# EAGLE design mppt (EAGLE 6.3)
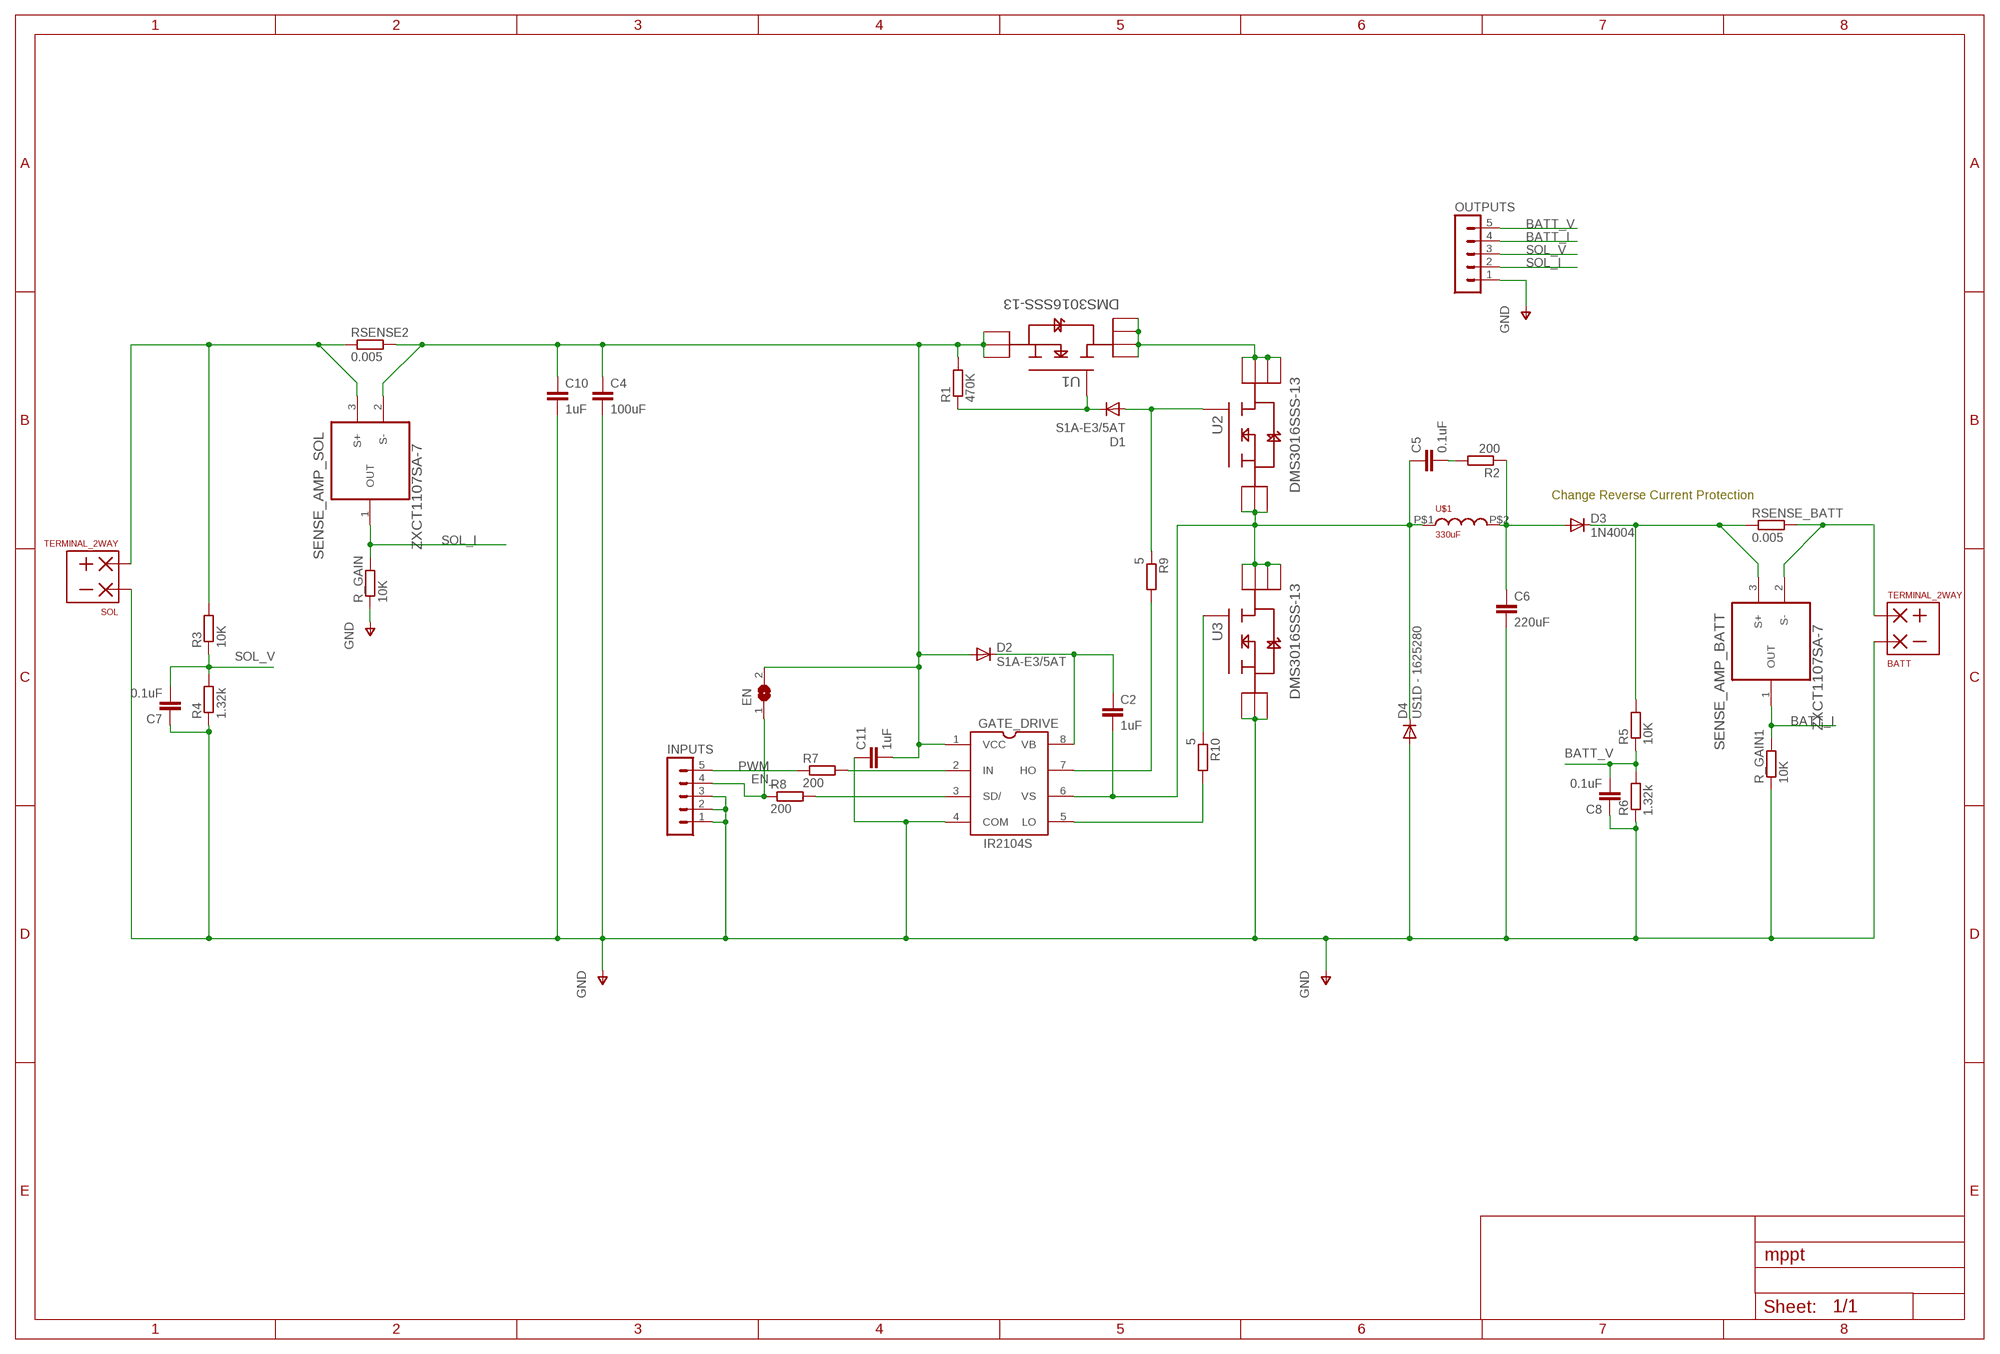
[diagram p0: schematic, sheet 1]

## Parts
BATT  TERMINAL_2WAY  [TERMINAL_2WAY]
C2  1uF  C-EUC0805K  [C0805K]
C4  100uF  C-EU025-050X050  [C025-050X050]
C5  0.1uF  C-EUC0805K  [C0805K]
C6  220uF  C-EU025-050X050  [C025-050X050]
C7  0.1uF  C-EUC0805K  [C0805K]
C8  0.1uF  C-EUC0805K  [C0805K]
C10  1uF  C-EUC0805K  [C0805K]
C11  1uF  C-EUC0805K  [C0805K]
D1  S1A-E3/5AT  DIODE-DO-214AC  [DO-214AC]
D2  S1A-E3/5AT  DIODE-DO-214AC  [DO-214AC]
D3  1N4004  [DO41-10]
D4  US1D - 1625280  DIODE-DO-214AC  [DO-214AC]
EN  SJ  [SJ]
GATE_DRIVE  IR2104S  [IR2104S]
INPUTS  MA05-1  [MA05-1]
OUTPUTS  MA05-1  [MA05-1]
R1  470K  R-EU_M0805  [M0805]
R2  200  R-EU_M0805  [M0805]
R3  10K  R-EU_M0805  [M0805]
R4  1.32k  R-EU_M0805  [M0805]
R5  10K  R-EU_M0805  [M0805]
R6  1.32k  R-EU_M0805  [M0805]
R7  200  R-EU_M0805  [M0805]
R8  200  R-EU_M0805  [M0805]
R9  5  R-EU_M0805  [M0805]
R10  5  R-EU_M0805  [M0805]
R_GAIN  10K  R-EU_M0805  [M0805]
R_GAIN1  10K  R-EU_M0805  [M0805]
RSENSE2  0.005  R-EU_R2512  [R2512]
RSENSE_BATT  0.005  R-EU_R2512  [R2512]
SENSE_AMP_BATT  ZXCT1107SA-7  [SOT91P240X110-3N]
SENSE_AMP_SOL  ZXCT1107SA-7  [SOT91P240X110-3N]
SOL  TERMINAL_2WAY  [TERMINAL_2WAY]
U1  DMS3016SSS-13  [SOIC127P600X175-8N]
U2  DMS3016SSS-13  [SOIC127P600X175-8N]
U3  DMS3016SSS-13  [SOIC127P600X175-8N]
U$1  330uF  INDUC_BOURNES_SDR1806  [BOURNS_SDR1806]

## Nets
BATT_I: OUTPUTS.4 R_GAIN1.2 SENSE_AMP_BATT.1(OUT)
BATT_V: C8.2 OUTPUTS.5 R5.1 R6.2
EN_: EN.1 INPUTS.4 R8.1
GND [pwr]: BATT.P$2 C4.2 C6.2 C7.1 C8.1 C10.2 C11.1 D4.A GATE_DRIVE.4(COM) INPUTS.1 INPUTS.2 INPUTS.3 OUTPUTS.1 R4.1 R6.1 R_GAIN1.1 R_GAIN.1 SOL.P$2 U3.1(S_2) U3.2(S_3) U3.3(S)
N$1 [pwr]: C6.1 D3.A R2.1 U$1.P$2
N$2: GATE_DRIVE.3(SD/) R8.2
N$3 [pwr]: BATT.P$1 RSENSE_BATT.2 SENSE_AMP_BATT.2(S-)
N$4 [pwr]: C2.2 C5.1 D4.C GATE_DRIVE.6(VS) U2.1(S_2) U2.2(S_3) U2.3(S) U3.5(D_3) U3.6(D_2) U3.7(D_4) U3.8(D) U$1.P$1
N$5: D1.C R1.1 U1.4(G)
N$6 [pwr]: U1.5(D_3) U1.6(D_2) U1.7(D_4) U1.8(D) U2.5(D_3) U2.6(D_2) U2.7(D_4) U2.8(D)
N$7: GATE_DRIVE.7(HO) R9.2
N$8: GATE_DRIVE.2(IN) R7.2
N$9 [pwr]: C4.1 C10.1 C11.2 D2.A EN.2 GATE_DRIVE.1(VCC) R1.2 RSENSE2.2 SENSE_AMP_SOL.2(S-) U1.1(S_2) U1.2(S_3) U1.3(S)
N$10: C2.1 D2.C GATE_DRIVE.8(VB)
N$11: R10.1 U3.4(G)
N$12 [pwr]: D3.C R5.2 RSENSE_BATT.1 SENSE_AMP_BATT.3(S+)
N$13: GATE_DRIVE.5(LO) R10.2
N$14: D1.A R9.1 U2.4(G)
N$15: C5.2 R2.2
N$16 [pwr]: R3.2 RSENSE2.1 SENSE_AMP_SOL.3(S+) SOL.P$1
PWM: INPUTS.5 R7.1
SOL_I: OUTPUTS.2 R_GAIN.2 SENSE_AMP_SOL.1(OUT)
SOL_V: C7.2 OUTPUTS.3 R3.1 R4.2

## Notes on the sheet
- Change Reverse Current Protection

## Library data of the parts
BATT SOL = equinox:TERMINAL_2WAY
C2 C4-C8 C10 C11 = resistor:C-EU: CAPACITOR, European symbol
D1 D2 D4 = diode:DIODE-: DIODE
D3 = diode:1N4004: DIODE general purpose rectifier, 1 A
EN = jumper:SJ: SMD solder JUMPER
GATE_DRIVE = equinox:IR2104S: Half Bridge Mosfet - IGBT driver SOIC
INPUTS OUTPUTS = con-lstb:MA05-1: PIN HEADER
R1-R10 R_GAIN R_GAIN1 RSENSE2 RSENSE_BATT = rcl:R-EU_: RESISTOR, European symbol
SENSE_AMP_BATT SENSE_AMP_SOL = equinox:ZXCT1107SA-7: LOW POWER HIGH-SIDE CURRENT MONITORS; MPN: ZXCT1107SA-7; OC_FARNELL: 1904027; OC_NEWARK: 55T4047; PACKAGE: SOT-23-3; SUPPLIER: DIODES INC.
U1-U3 = equinox:DMS3016SSS-13: ENHANCEMENT MODE MOSFET; MPN: DMS3016SSS-13; OC_FARNELL: 1863729; OC_NEWARK: 27T2704; PACKAGE: SOIC-8; SUPPLIER: DIODES INC.
U$1 = lib:INDUC_BOURNES_SDR1806: Datasheet: http://www.bourns.com/data/global/pdfs/SDR1806.pdf Onecall #: 1929705

## Net classes
0 default: width 0.381 mm, drill 0.61 mm, clearance 0.381 mm
1 pwr: width 0.026 mm, drill 0.61 mm, clearance 0.762 mm

## Board
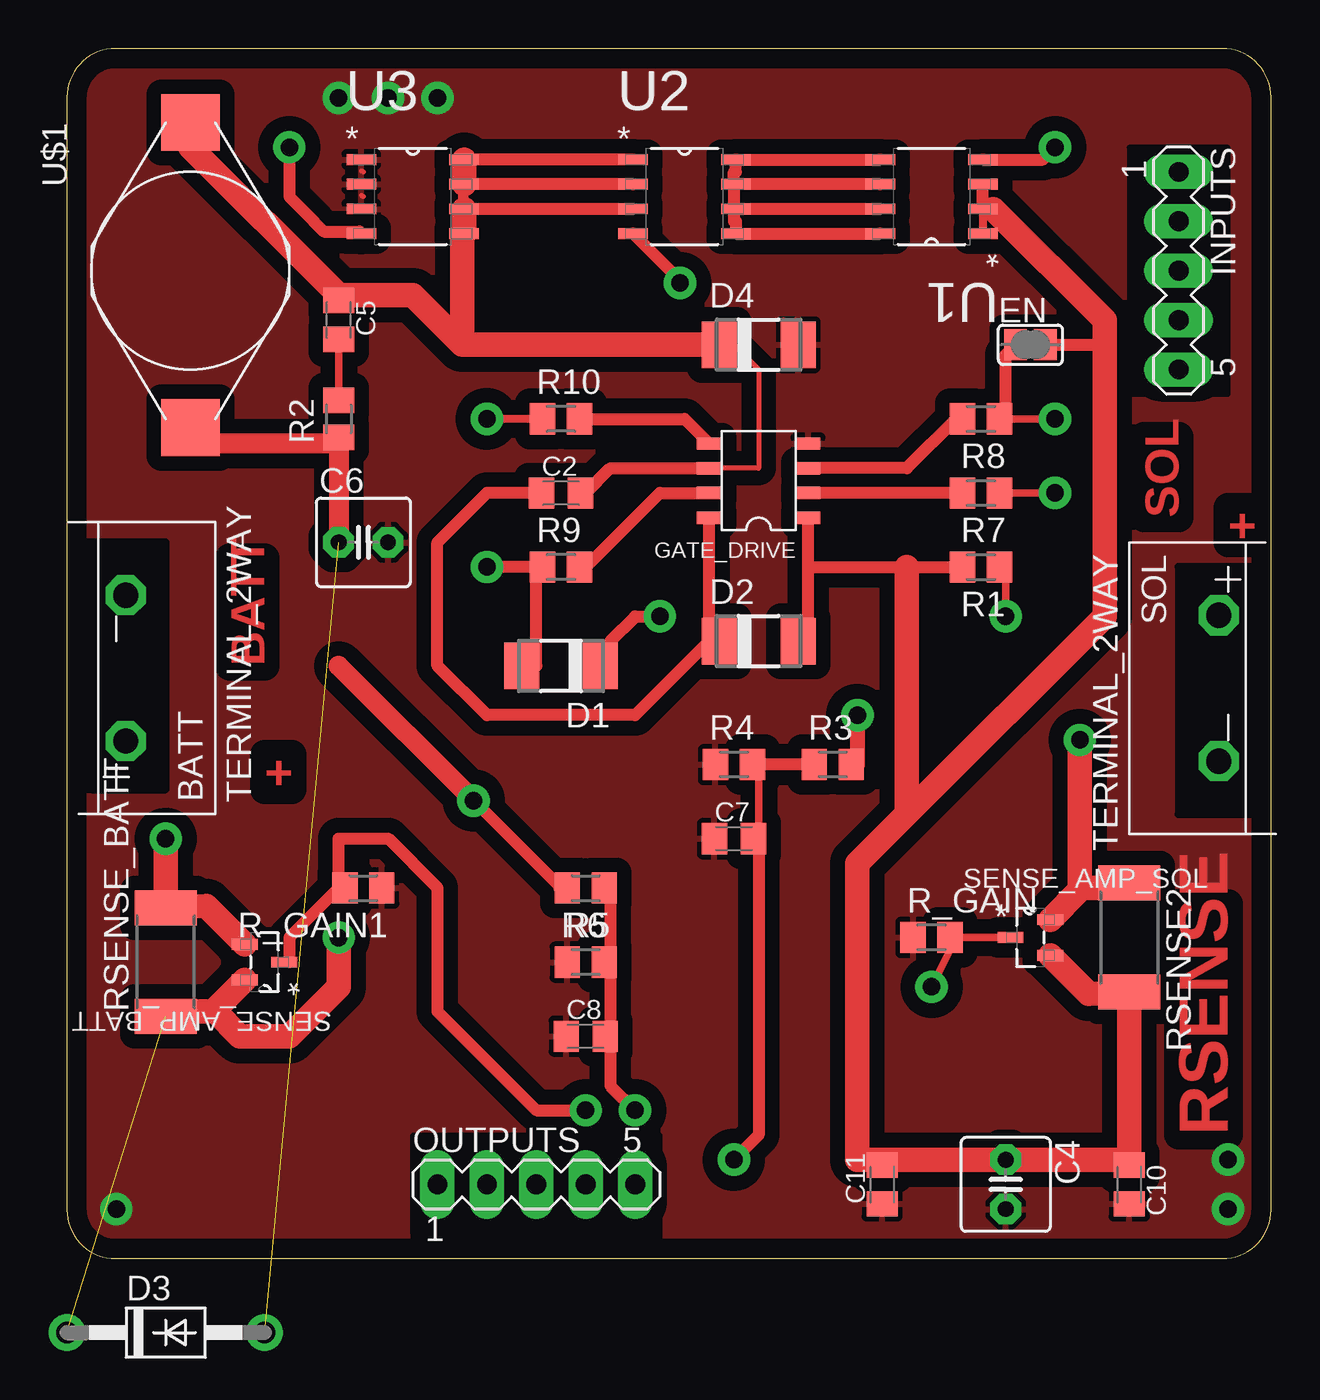
[diagram p1: board, top side]
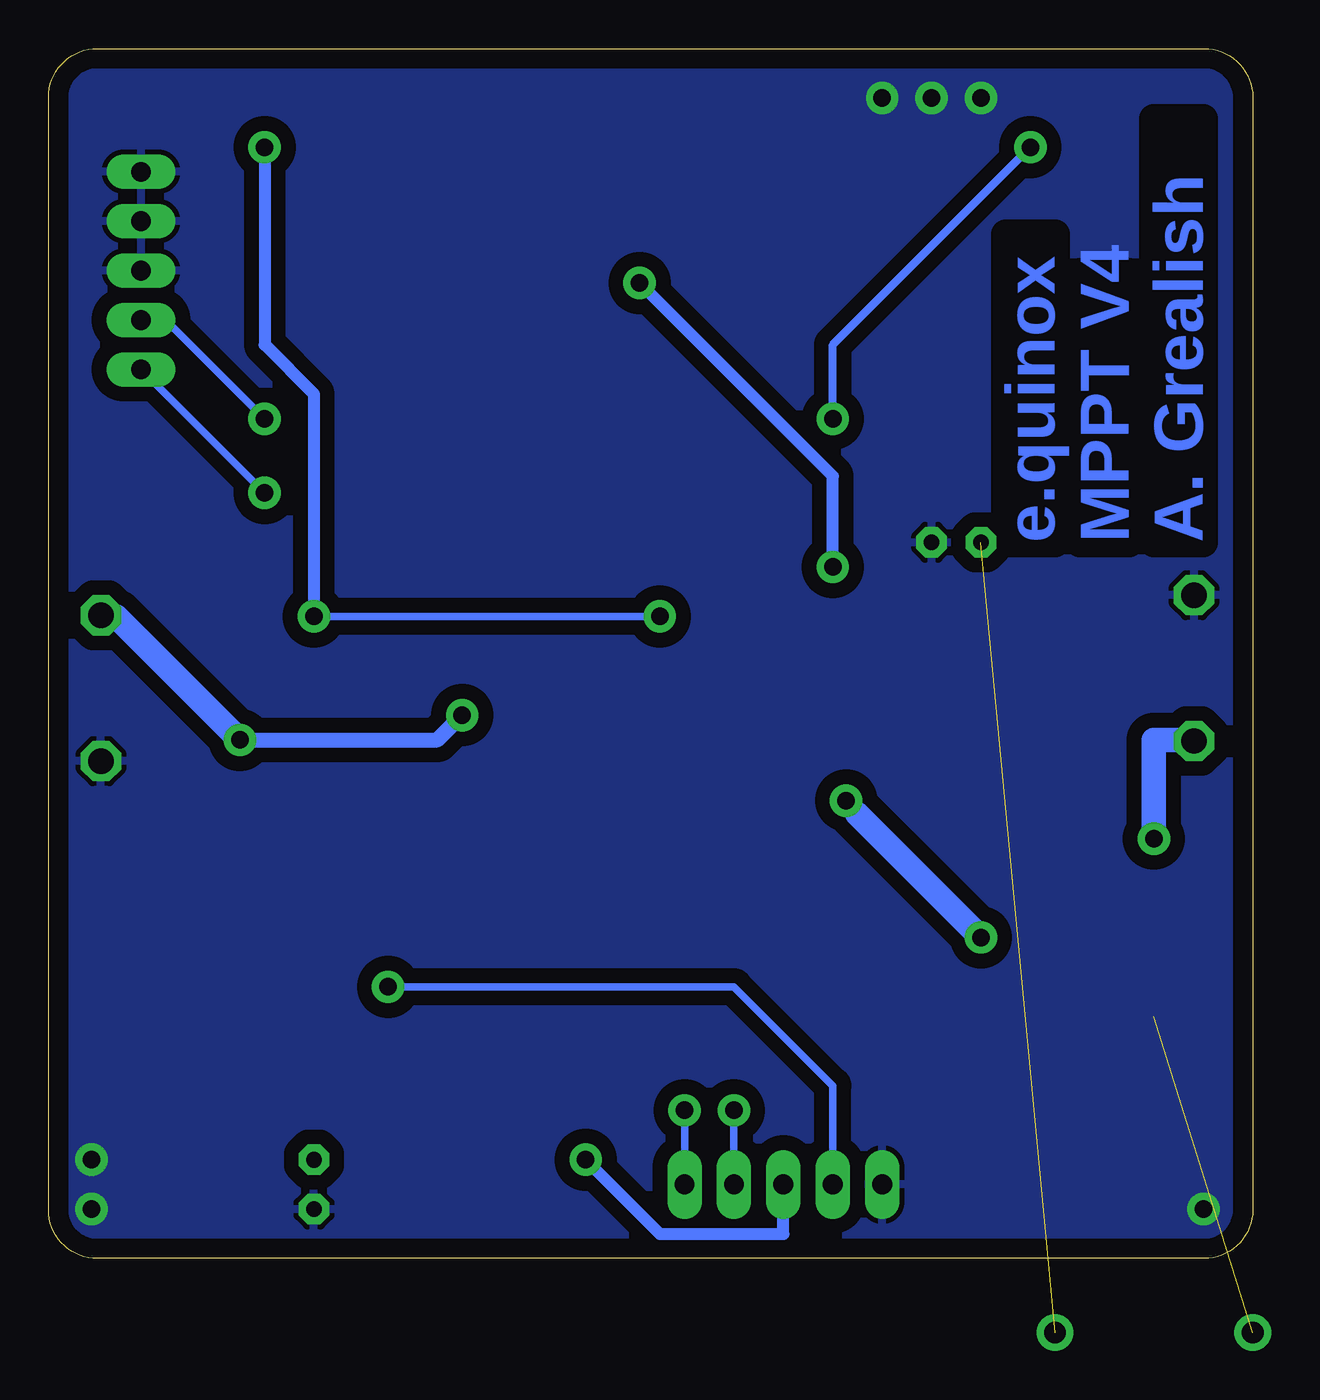
[diagram p2: board, bottom side, seen from below]

Size 61.9 x 62.22 mm. Coordinates in mm from the lower left corner, seen from the top.
Outline: 0,59.72 0,2.5 arc90 2.5,0 59.4,0 arc90 61.9,2.5 61.9,59.72 arc90 59.4,62.22 2.5,62.22 arc90 0,59.72
Copper layers (1*16): Top 0.0356mm / dielectric 1.5011mm / Bottom 0.0356mm
Design rules "ee_rules_10mil": minimum track width 10mil, minimum drill 24mil, track to track 10mil, track to pad 15mil, pad to pad 15mil, via to via 15mil, smd to smd 8mil, copper to edge 40mil, drill to drill 15mil, minimum pad ring 15mil, minimum via ring 15mil, stop-mask expansion 4mil, vias tented up to drill 0mil, thermal gap 10mil
tRestrict: area 17.8,1.3 to 30.5,6.3; area 54.6,44.5 to 59.7,57.1; area 1.3,24.1 to 5.1,36.8; area 57.1,22.9 to 61,35.6

### Footprints (pad centres in the part's own frame; a part is rotated, then mirrored left to right if it is on the bottom)
TERMINAL_2WAY = drill 1.3 octagon: P$1 3.75,4.6; P$2 11.25,4.6
C0805K = smd 1.3 x 1.6: 1 -1,0; 2 1,0
C025-050X050 = drill 0.813 octagon: 1 -1.27,0; 2 1.27,0
DO-214AC = smd 1.8 x 2.4: A 2.025,0; C -2.025,0
DO41-10 = drill 1.118: A 5.08,0; C -5.08,0
SJ = smd 1.168 x 1.6: 1 -0.762,0; 2 0.762,0
IR2104S = smd 1.27 x 0.635: 1 0,3.81; 2 0,2.54; 3 0,1.27; 4 0,0; 5 5.08,0; 6 5.08,1.27; 7 5.08,2.54; 8 5.08,3.81
MA05-1 = drill 1.016 long: 1 -5.08,0; 2 -2.54,0; 3 0,0; 4 2.54,0; 5 5.08,0
M0805 = smd 1.3 x 1.6: 1 -0.95,0; 2 0.95,0
R2512 = smd 1.8 x 3.2: 1 -2.8,0; 2 2.8,0
SOT91P240X110-3N = smd 1.321 x 0.559: 1 -1.016,0; 2 1.016,-0.914; 3 1.016,0.914
SOIC127P600X175-8N = smd 1.524 x 0.559: 1 -2.642,1.905; 2 -2.642,0.635; 3 -2.642,-0.635; 4 -2.642,-1.905; 5 2.642,-1.905; 6 2.642,-0.635; 7 2.642,0.635; 8 2.642,1.905
BOURNS_SDR1806 = smd 2.921 x 2.997: P$1 0,0; P$2 15.697,0

### Placement (x,y rotation side)
BATT  7.62,22.86 90 top
C2  25.4,39.37 0 top
C4  48.26,3.81 270 top
C5  13.97,48.26 270 top
C6  15.24,36.83 0 top
C7  34.29,21.59 0 top
C8  26.67,11.43 0 top
C10  54.61,3.81 270 top
C11  41.91,3.81 90 top
D1  25.4,30.48 180 top
D2  35.56,31.75 0 top
D3  5.08,-3.81 0 top  (outside the outline)
D4  35.56,46.99 0 top
EN  49.53,46.99 0 top
GATE_DRIVE  38.1,41.91 180 top
INPUTS  57.15,50.8 270 top
OUTPUTS  24.13,3.81 0 top
R1  46.99,35.56 180 top
R2  13.97,43.18 90 top
R3  39.37,25.4 0 top
R4  34.29,25.4 0 top
R5  26.67,19.05 180 top
R6  26.67,15.24 0 top
R7  46.99,39.37 180 top
R8  46.99,43.18 180 top
R9  25.4,35.56 0 top
R10  25.4,43.18 0 top
R_GAIN  44.45,16.51 0 top
R_GAIN1  15.24,19.05 180 top
RSENSE2  54.61,16.51 270 top
RSENSE_BATT  5.08,15.24 90 top
SENSE_AMP_BATT  10.16,15.24 180 top
SENSE_AMP_SOL  49.53,16.51 0 top
SOL  54.61,36.83 270 top
U1  44.45,54.61 180 top
U2  31.75,54.61 0 top
U3  17.78,54.61 0 top
U$1  6.35,58.42 270 top

### Tracks (layer width: path | path; a pad name or v marks a point on that pad's centre or on a via)
BATT_I  (via drill 0.9)
  Top 0.381: 11.43,15.24 SENSE_AMP_BATT.1 | 13.97,19.05 R_GAIN1.2
  Top 0.61: 11.43,15.24 11.43,16.51 13.97,19.05 13.97,21.59 16.51,21.59 19.05,19.05 19.05,12.7 24.13,7.62 v26.67,7.62
  Bottom 0.381: v26.67,7.62 OUTPUTS.4
BATT_V  (via drill 0.9)
  Top 0.381: 27.94,19.05 R5.1 | 27.94,15.24 R6.2 | 27.94,11.43 C8.2
  Top 0.61: 27.94,19.05 27.94,15.24 27.94,11.43 27.94,8.89 v29.21,7.62
  Bottom 0.381: v29.21,7.62 OUTPUTS.5
EN_  (via drill 0.9)
  Top 0.381: v50.8,43.18 48.26,43.18 R8.1
  Top 0.61: 48.26,43.18 48.26,46.48 EN.1
  Bottom 0.381: v50.8,43.18 55.88,48.26 INPUTS.4
GND  (via drill 0.9)
  Top 0.254: 15.24,54.61 15.14,54.66 | 15.24,55.88 15.14,55.93 | 36.83,48.26 37.43,48.26 | 36.83,46.99 D4.A
  other vias: 2.54,2.54 59.69,5.08 59.69,2.54 13.97,59.69 16.51,59.69 19.05,59.69
  pour Bottom: 0,0 62.23,0 62.23,62.23 0,62.23
  pour Top: 0,0 62.23,0 62.23,62.23 0,62.23
N$1  (1 unrouted)
  Top 0.762: 6.35,41.91 U$1.P$2 | 13.97,41.91 R2.1
  Top 1.016: C6.1 13.97,41.91 6.35,41.91
N$2
  Top 0.381: 45.72,43.18 R8.2
  Top 0.61: GATE_DRIVE.3 43.18,40.64 45.72,43.18
N$3  (via drill 0.9)
  Top 1.27: v5.08,21.59 RSENSE_BATT.2 7.16,18.14 SENSE_AMP_BATT.2
  Bottom 0.254: 3.81,26.67 BATT.P$1
  Bottom 1.27: v5.08,21.59 5.08,26.67 3.81,26.67
N$4
  Top 0.254: GATE_DRIVE.6 35.56,40.64 35.56,45.72 34.29,46.99 D4.C
  Top 0.381: 26.67,39.37 C2.2 | U$1.P$1 6.35,57.15 | 13.97,49.53 C5.1
  Top 0.406: U3.5 20.32,52.7 | U3.7 U3.6 20.42,54.61 20.32,54.61 20.32,53.98
  Top 0.61: GATE_DRIVE.6 27.94,40.64 26.67,39.37 | U2.1 U3.8 | U2.2 U3.7 | U2.3 20.32,53.98
  Top 1.27: 6.35,57.15 13.97,49.53 17.78,49.53 20.32,46.99 | 20.32,46.99 D4.C | 20.32,52.7 20.32,46.99 | U3.5 U3.6 | U3.7 U3.8
N$5  (via drill 0.9)
  Top 0.381: v48.26,33.02 48.26,35.56 R1.1
  Top 0.61: v30.48,33.02 29.21,33.02 27.94,31.75 D1.C | U1.4 50.16,56.52 v50.8,57.15
  Bottom 0.381: v30.48,33.02 v48.26,33.02
  Bottom 0.61: v50.8,57.15 50.8,46.99 48.26,44.45 v48.26,33.02
N$6
  Top 0.61: U1.5 U2.8 34.39,55.88 34.29,55.88 34.29,55.24 | U1.6 U2.7 34.29,55.24 | U1.8 U2.5 34.39,53.34 34.29,53.34 34.29,53.98 | U1.7 U2.6 34.29,53.98 | 34.29,55.24 34.29,53.98
N$7
  Top 0.381: 26.67,35.56 R9.2
  Top 0.61: GATE_DRIVE.7 30.48,39.37 26.67,35.56
N$8
  Top 0.61: R7.2 GATE_DRIVE.2
N$9
  Top 0.254: 38.1,31.75 D2.A | 41.91,5.08 C11.2 | 54.61,5.08 C10.1
  Top 0.406: U1.2 U1.1
  Top 0.61: 38.1,31.75 38.1,35.56 | 38.1,35.56 GATE_DRIVE.1 | 38.1,35.56 43.18,35.56 R1.2 | 47.62,53.98 U1.2 U1.3 | EN.2 53.34,46.99
  Top 1.27: SENSE_AMP_SOL.2 52.53,13.61 RSENSE2.2 54.61,5.08 C4.1 41.91,5.08 40.64,5.08 40.64,20.32 43.18,22.86 | 43.18,22.86 43.18,35.56 | 47.62,53.98 53.34,48.26 53.34,46.99 53.34,33.02 43.18,22.86
N$10
  Top 0.381: 24.13,39.37 C2.1 | 33.02,31.75 D2.C
  Top 0.61: GATE_DRIVE.8 33.02,31.75 29.21,27.94 21.59,27.94 19.05,30.48 19.05,36.83 21.59,39.37 24.13,39.37
N$11  (via drill 0.9)
  Top 0.406: R10.1 v21.59,43.18 | 12.7,53.34 12.7,53.31
  Top 0.61: v11.43,57.15 11.43,54.61 12.7,53.34 | 12.7,53.31 13.21,52.81 15.04,52.81 U3.4
  Bottom 0.406: v21.59,43.18 21.59,46.99 v11.43,57.15
N$12  (via drill 0.9)  (1 unrouted)
  Top 0.254: 7.62,12.7 7.52,12.7
  Top 0.61: v20.9,23.55 25.4,19.05
  Top 0.762: 5.08,12.7 RSENSE_BATT.1 | 25.4,19.05 R5.2
  Top 1.016: 13.97,30.48 v20.9,23.55
  Top 1.27: 5.08,12.7 7.52,12.7 SENSE_AMP_BATT.3 | 7.62,12.7 8.89,11.43 11.43,11.43 13.97,13.97 v13.97,16.51
  Bottom 0.762: v20.9,23.55 20.32,22.86
  Bottom 1.27: 20.32,22.86 v13.97,16.51
N$13
  Top 0.381: 26.67,43.18 R10.2
  Top 0.61: 26.67,43.18 31.75,43.18 GATE_DRIVE.5
N$14  (via drill 0.9)
  Top 0.381: 24.13,35.56 R9.1 | 24.13,30.48 D1.A
  Top 0.406: v31.52,50.16 31.52,50.29
  Top 0.61: 24.13,30.48 24.13,35.56 | R9.1 v21.59,35.56 | 31.52,50.29 U2.4
  Bottom 0.61: v21.59,35.56 21.59,40.23 v31.52,50.16
N$15
  Top 0.381: C5.2 R2.2
N$16  (via drill 0.9)
  Top 0.406: 52.07,19.05 52.07,18.95
  Top 0.762: v40.64,27.94 40.64,25.4 R3.2 | 54.61,19.05 RSENSE2.1
  Top 1.27: 54.61,19.05 52.07,19.05 v52.07,26.67 | 52.07,18.95 SENSE_AMP_SOL.3
  Bottom 0.762: v40.64,27.94 41.91,26.67 v52.07,26.67
  Bottom 1.27: v52.07,26.67 58.42,33.02 SOL.P$1
PWM  (via drill 0.9)
  Top 0.381: v50.8,39.37 R7.1
  Bottom 0.381: INPUTS.5 v50.8,39.37
SOL_I  (via drill 0.9)
  Top 0.381: 45.72,16.51 SENSE_AMP_SOL.1 | v44.45,13.97 45.72,16.51 | 45.72,16.51 R_GAIN.2
  Bottom 0.381: v44.45,13.97 26.67,13.97 21.59,8.89 OUTPUTS.2
SOL_V  (via drill 0.9)
  Top 0.381: R4.2 35.56,25.4 35.56,21.59 C7.2
  Top 0.61: R3.1 35.56,25.4 | v34.29,5.08 35.56,6.35 35.56,21.59
  Bottom 0.61: OUTPUTS.3 24.13,1.27 30.48,1.27 v34.29,5.08

### Text on the board
Top: SOL | + | BATT | + | RSENSE
Bottom: A. Grealish | MPPT V4 | e.quinox